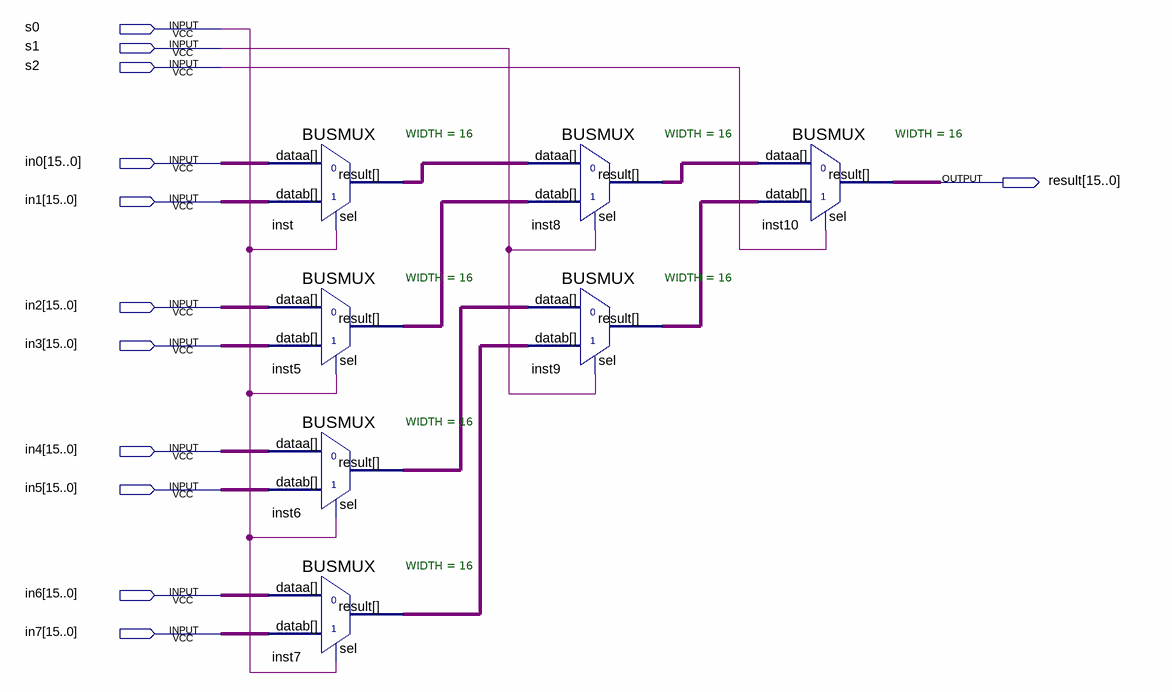
[diagram p0: schematic sheet]
// Quartus schematic mux_8x16.bdf as structural Verilog: 7 symbols, 12 pins
module mux_8x16 (
  input  s0,
  input  s1,
  input  s2,
  input  [15:0] in0,
  input  [15:0] in1,
  input  [15:0] in2,
  input  [15:0] in3,
  input  [15:0] in4,
  input  [15:0] in5,
  input  [15:0] in6,
  input  [15:0] in7,
  output [15:0] result
);

  wire [15:0] inst5_result, inst6_result, inst7_result, inst8_result, inst9_result, inst_result;

  BUSMUX #(.WIDTH(16)) inst (.datab(in1), .sel(s0), .dataa(in0), .result(inst_result));
  BUSMUX #(.WIDTH(16)) inst5 (.datab(in3), .sel(s0), .dataa(in2), .result(inst5_result));
  BUSMUX #(.WIDTH(16)) inst6 (.datab(in5), .sel(s0), .dataa(in4), .result(inst6_result));
  BUSMUX #(.WIDTH(16)) inst7 (.datab(in7), .sel(s0), .dataa(in6), .result(inst7_result));
  BUSMUX #(.WIDTH(16)) inst8 (.datab(inst5_result), .sel(s1), .dataa(inst_result), .result(inst8_result));
  BUSMUX #(.WIDTH(16)) inst9 (.datab(inst7_result), .sel(s1), .dataa(inst6_result), .result(inst9_result));
  BUSMUX #(.WIDTH(16)) inst10 (.datab(inst9_result), .sel(s2), .dataa(inst8_result), .result(result));
endmodule
